# EAGLE design pic18f44k22 dip to tqfp (EAGLE 9.4.0)
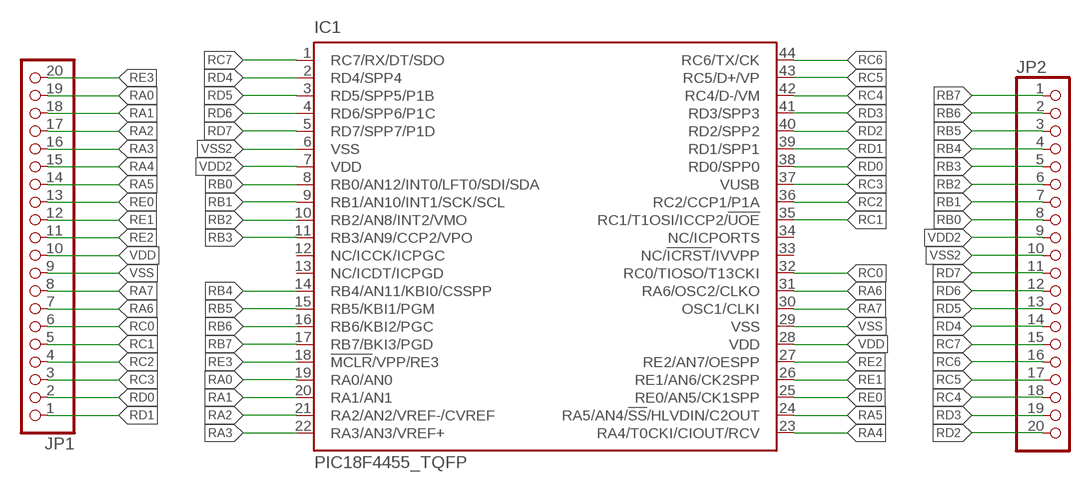
[diagram p0: schematic, sheet 1]

## Parts
IC1  PIC18F4455_TQFP  [TQFP44]
JP1  PINHD-1X20_2.54-SMD  [1X20SMD]
JP2  PINHD-1X20_2.54-SMD  [1X20SMD]

## Nets
RA0: IC1.19(RA0/AN0) JP1.19
RA1: IC1.20(RA1/AN1) JP1.18
RA2: IC1.21(RA2/AN2/VREF-/CVREF) JP1.17
RA3: IC1.22(RA3/AN3/VREF+) JP1.16
RA4: IC1.23(RA4/T0CKI/CIOUT/RCV) JP1.15
RA5: IC1.24(RA5/AN4/!SS!/HLVDIN/C2OUT) JP1.14
RA6: IC1.31(RA6/OSC2/CLKO) JP1.7
RA7: IC1.30(OSC1/CLKI) JP1.8
RB0: IC1.8(RB0/AN12/INT0/LFT0/SDI/SDA) JP2.8
RB1: IC1.9(RB1/AN10/INT1/SCK/SCL) JP2.7
RB2: IC1.10(RB2/AN8/INT2/VMO) JP2.6
RB3: IC1.11(RB3/AN9/CCP2/VPO) JP2.5
RB4: IC1.14(RB4/AN11/KBI0/CSSPP) JP2.4
RB5: IC1.15(RB5/KBI1/PGM) JP2.3
RB6: IC1.16(RB6/KBI2/PGC) JP2.2
RB7: IC1.17(RB7/BKI3/PGD) JP2.1
RC0: IC1.32(RC0/TIOSO/T13CKI) JP1.6
RC1: IC1.35(RC1/T1OSI/ICCP2/!UOE) JP1.5
RC2: IC1.36(RC2/CCP1/P1A) JP1.4
RC3: IC1.37(VUSB) JP1.3
RC4: IC1.42(RC4/D-/VM) JP2.18
RC5: IC1.43(RC5/D+/VP) JP2.17
RC6: IC1.44(RC6/TX/CK) JP2.16
RC7: IC1.1(RC7/RX/DT/SDO) JP2.15
RD0: IC1.38(RD0/SPP0) JP1.2
RD1: IC1.39(RD1/SPP1) JP1.1
RD2: IC1.40(RD2/SPP2) JP2.20
RD3: IC1.41(RD3/SPP3) JP2.19
RD4: IC1.2(RD4/SPP4) JP2.14
RD5: IC1.3(RD5/SPP5/P1B) JP2.13
RD6: IC1.4(RD6/SPP6/P1C) JP2.12
RD7: IC1.5(RD7/SPP7/P1D) JP2.11
RE0: IC1.25(RE0/AN5/CK1SPP) JP1.13
RE1: IC1.26(RE1/AN6/CK2SPP) JP1.12
RE2: IC1.27(RE2/AN7/OESPP) JP1.11
RE3: IC1.18(!MCLR!/VPP/RE3) JP1.20
VDD: IC1.28(VDD) JP1.10
VDD2: IC1.7(VDD) JP2.9
VSS: IC1.29(VSS) JP1.9
VSS2: IC1.6(VSS) JP2.10
Unconnected: IC1.12(NC/ICCK/ICPGC) IC1.13(NC/ICDT/ICPGD) IC1.33(NC/!ICRST!/IVVPP) IC1.34(NC/ICPORTS)

## Library data of the parts
IC1 = microchip:PIC18F4*_TQFP: USB Microcontrollers with nanoWatt Technology High-Performance, Enhanced Flash, 28/40/44-Pin, Source: http://ww1.microchip.com/downloads/en/devicedoc/39632c.pdf; MF: MICROCHIP; MPN: PIC18F4455-I/PT; OC_FARNELL: 9321322; OC_NEWARK: 08J9628
JP1 JP2 = pinhead-2:PINHD-1X20: PIN HEADER

## Board
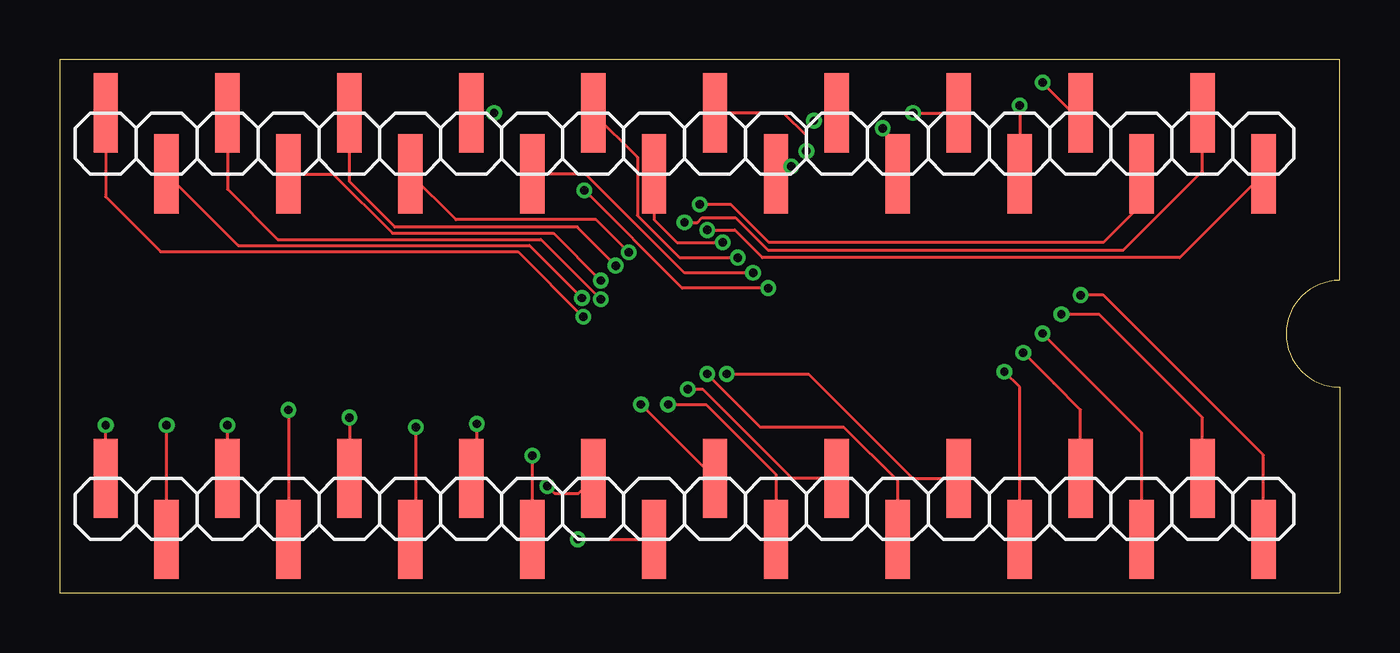
[diagram p1: board, top side]
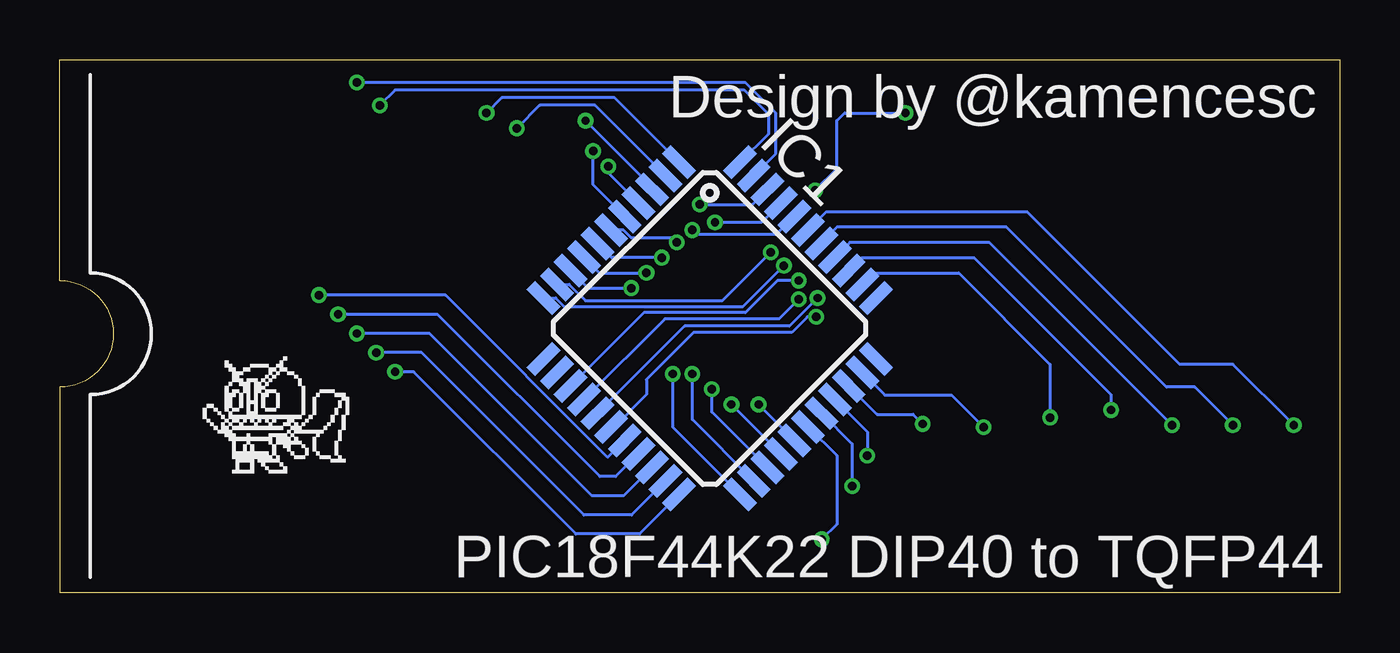
[diagram p2: board, bottom side, seen from below]

Size 53.34 x 22.21 mm. Coordinates in mm from the lower left corner, seen from the top.
Outline: 0,0 53.34,0 53.34,8.57 arc-180 53.34,13.02 53.34,22.21 0,22.21 0,0
Copper layers (1*16): Top 0.035mm / dielectric 1.5mm / Bottom 0.035mm
Design rules "dirtypcbs_2_layer": minimum track width 5mil, minimum drill 12mil, track to track 5mil, track to pad 5mil, pad to pad 5mil, via to via 5mil, smd to smd 0mil, copper to edge 10mil, drill to drill 10mil, minimum pad ring 10mil, minimum via ring 6mil, stop-mask expansion 2mil, vias tented up to drill 25mil, thermal gap 10mil

### Footprints (pad centres in the part's own frame; a part is rotated, then mirrored left to right if it is on the bottom)
TQFP44 = smd 1.5 x 0.5: 1 -5.8,4; 2 -5.8,3.2; 3 -5.8,2.4; 4 -5.8,1.6; 5 -5.8,0.8; 6 -5.8,0; 7 -5.8,-0.8; 8 -5.8,-1.6; 9 -5.8,-2.4; 10 -5.8,-3.2; 11 -5.8,-4; 23 5.8,-4; 24 5.8,-3.2; 25 5.8,-2.4; 26 5.8,-1.6; 27 5.8,-0.8; 28 5.8,0; 29 5.8,0.8; 30 5.8,1.6; 31 5.8,2.4; 32 5.8,3.2; 33 5.8,4 | smd 0.5 x 1.5: 12 -4,-5.8; 13 -3.2,-5.8; 14 -2.4,-5.8; 15 -1.6,-5.8; 16 -0.8,-5.8; 17 0,-5.8; 18 0.8,-5.8; 19 1.6,-5.8; 20 2.4,-5.8; 21 3.2,-5.8; 22 4,-5.8; 34 4,5.8; 35 3.2,5.8; 36 2.4,5.8; 37 1.6,5.8; 38 0.8,5.8; 39 0,5.8; 40 -0.8,5.8; 41 -1.6,5.8; 42 -2.4,5.8; 43 -3.2,5.8; 44 -4,5.8
1X20SMD = smd 1.016 x 3.302: 1 -1.27,1.27; 2 1.27,-1.27; 3 3.81,1.27; 4 6.35,-1.27; 5 8.89,1.27; 6 11.43,-1.27; 7 13.97,1.27; 8 16.51,-1.27; 9 19.05,1.27; 10 21.59,-1.27; 11 24.13,1.27; 12 26.67,-1.27; 13 29.21,1.27; 14 31.75,-1.27; 15 34.29,1.27; 16 36.83,-1.27; 17 39.37,1.27; 18 41.91,-1.27; 19 44.45,1.27; 20 46.99,-1.27

### Placement (x,y rotation side)
IC1  26.26,11.02 315 bottom
JP1  3.17,3.49 0 top
JP2  3.17,18.73 0 top

### Tracks (layer width: path | path; a pad name or v marks a point on that pad's centre or on a via)
RA0  (via drill 0.35)
  Top 0.127: JP1.19 47.62,7.3 43.32,11.61 v41.75,11.61
  Bottom 0.127: IC1.19 30.17,4.84 30.84,4.84 37.6,11.61 v41.75,11.61
RA1  (via drill 0.35)
  Top 0.127: JP1.18 45.09,6.68 v40.96,10.81
  Bottom 0.127: IC1.20 29.84,4.04 31.17,4.04 37.93,10.81 v40.96,10.81
RA2  (via drill 0.35)
  Top 0.127: 41.43,8.74 | v40.16,10.01 41.43,8.74 | JP1.17 42.55,7.62 41.43,8.74
  Bottom 0.127: IC1.21 29.51,3.24 31.5,3.24 38.26,10.01 v40.16,10.01
RA3  (via drill 0.35)
  Top 0.127: JP1.16 40.01,8.57 v39.37,9.21
  Bottom 0.127: v39.37,9.21 38.59,9.21 31.83,2.44 29.18,2.44 IC1.22
RA4  (via drill 0.35)
  Top 0.127: v27.79,9.12 31.2,9.12 35.56,4.76 JP1.15
  Bottom 0.127: v27.79,9.12 27.79,6.9 IC1.23
RA5  (via drill 0.35)
  Top 0.127: JP1.14 34.93,4.65 32.68,6.9 29.2,6.9 v26.98,9.12
  Bottom 0.127: v26.98,9.12 26.98,7.21 IC1.24
RA6  (via drill 0.35)
  Top 0.127: v17.37,7.03 17.37,4.99 JP1.7
  Bottom 0.127: IC1.31 19.28,7.44 17.78,7.44 v17.37,7.03
RA7  (via drill 0.35)
  Top 0.127: v19.68,5.71 JP1.8
  Bottom 0.127: IC1.30 19.68,6.71 v19.68,5.71
RB0  (via drill 0.35)
  Top 0.127: v28.89,13.33 26.04,13.33 21.91,17.46 JP2.8
  Bottom 0.127: IC1.8 30.84,13.33 v28.89,13.33
RB1  (via drill 0.35)
  Top 0.127: v29.53,12.7 25.94,12.7 v21.86,16.78 | v18.1,20 JP2.7
  Bottom 0.127: IC1.9 31.33,12.7 v29.53,12.7 | v21.86,16.78 20.95,17.68 20.95,19.69 20.64,20 v18.1,20
RB2  (via drill 0.35)
  Top 0.127: v23.71,14.19 22.35,15.56 16.51,15.56 JP2.6
  Bottom 0.127: IC1.10 32.12,12.86 31.44,12.18 25.72,12.18 v23.71,14.19
RB3  (via drill 0.35)
  Top 0.127: v23.16,13.64 21.59,15.21 21.59,15.24 13.97,15.24 12.06,17.14 JP2.5
  Bottom 0.127: IC1.11 32.68,12.29 32.32,11.93 24.87,11.93 v23.16,13.64
RB4  (via drill 0.35)
  Top 0.127: v22.54,13.02 20.57,14.99 13.87,14.99 11.39,17.46 JP2.4
  Bottom 0.127: v22.54,13.02 23.42,13.02 24.77,11.67 29,11.67 IC1.14
RB5  (via drill 0.35)
  Top 0.127: JP2.3 6.99,16.83 9.08,14.73 20.05,14.73 v22.54,12.24
  Bottom 0.127: v22.54,12.24 23.36,11.42 28.12,11.42 IC1.15
RB6  (via drill 0.35)
  Top 0.127: JP2.2 7.43,14.48 19.57,14.48 v21.76,12.29
  Bottom 0.127: v21.76,12.29 22.93,11.11 27.3,11.11 IC1.16
RB7  (via drill 0.35)
  Top 0.127: JP2.1 1.91,16.51 4.19,14.22 19.09,14.22 v21.81,11.5
  Bottom 0.127: v21.81,11.5 22.18,11.5 22.83,10.86 26.92,10.86 28.89,8.89 28.89,8.25 30.23,6.92 IC1.17
RC0  (via drill 0.35)
  Top 0.127: v14.83,6.9 14.83,2.45 JP1.6
  Bottom 0.127: IC1.32 18.95,8.24 16.17,8.24 v14.83,6.9
RC1  (via drill 0.35)
  Top 0.127: v12.06,7.3 JP1.5
  Bottom 0.127: IC1.35 19.42,13.33 15.88,13.33 12.06,9.52 v12.06,7.3
RC2  (via drill 0.35)
  Top 0.127: v9.53,7.62 JP1.4
  Bottom 0.127: IC1.36 19.91,13.97 15.24,13.97 9.53,8.25 v9.53,7.62
RC3  (via drill 0.35)
  Top 0.127: JP1.3 v6.99,6.99
  Bottom 0.127: IC1.37 20.41,14.6 14.61,14.6 v6.99,6.99
RC4  (via drill 0.35)
  Top 0.127: JP2.18 45.09,16.19 43.5,14.6 29.55,14.6 27.96,16.19 v26.67,16.19
  Bottom 0.127: v26.67,16.19 24.48,16.19 IC1.42
RC5  (via drill 0.35)
  Top 0.127: v40.96,21.27 42.23,20 JP2.17
  Bottom 0.127: IC1.43 23.49,18.31 23.49,20 24.76,21.27 v40.96,21.27
RC6  (via drill 0.35)
  Top 0.127: v40.01,20.32 JP2.16
  Bottom 0.127: v40.01,20.32 39.37,20.96 24.81,20.96 23.81,19.96 23.81,19.12 IC1.44
RC7  (via drill 0.35)
  Top 0.127: v35.56,20 JP2.15
  Bottom 0.127: IC1.1 30.22,20.64 34.93,20.64 v35.56,20
RD0  (via drill 0.35)
  Top 0.127: JP1.2 v4.45,6.99
  Bottom 0.127: v4.45,6.99 6.03,8.57 7.22,8.57 13.89,15.24 20.95,15.24 21.59,14.6 IC1.38
RD1  (via drill 0.35)
  Top 0.127: JP1.1 v1.91,6.99
  Bottom 0.127: v1.91,6.99 4.45,9.52 6.67,9.52 13.02,15.87 21.4,15.87 IC1.39
RD2  (via drill 0.35)
  Top 0.127: JP2.20 46.67,13.97 29.28,13.97 28.13,15.12 v26.99,15.12
  Bottom 0.127: IC1.40 23.49,14.92 26.79,14.92 v26.99,15.12
RD3  (via drill 0.35)
  Top 0.127: v26.04,15.44 26.57,15.44 26.77,15.64 28.15,15.64 29.51,14.29 44.34,14.29 47.62,17.57 JP2.19
  Bottom 0.127: IC1.41 24.1,15.44 v26.04,15.44
RD4  (via drill 0.35)
  Top 0.127: v34.29,19.37 34.93,18.73 JP2.14
  Bottom 0.127: IC1.2 31.04,20.32 33.34,20.32 v34.29,19.37
RD5  (via drill 0.35)
  Top 0.127: JP2.13 31.75,20 v31.43,19.69
  Bottom 0.127: v31.43,19.69 28.66,16.92 IC1.3
RD6  (via drill 0.35)
  Top 0.127: v30.48,17.78 30.16,17.46 JP2.12
  Bottom 0.127: IC1.4 30.48,17.5 v30.48,17.78
RD7  (via drill 0.35)
  Top 0.127: v31.11,18.42 31.11,19.05 30.16,20 JP2.11
  Bottom 0.127: IC1.5 31.11,17.01 v31.11,18.42
RE0  (via drill 0.35)
  Top 0.127: JP1.13 30.52,4.76 26.8,8.48 v26.16,8.48
  Bottom 0.127: IC1.25 24.56,5.93 | 24.56,5.93 | v26.16,8.48 26.16,7.53 24.56,5.93
RE1  (via drill 0.35)
  Top 0.127: v25.35,7.85 26.94,7.85 29.84,4.94 JP1.12
  Bottom 0.127: IC1.26 24,6.5 | 24,6.5 | 24,6.5 v25.35,7.85
RE2  (via drill 0.35)
  Top 0.127: JP1.11 v24.22,7.85 | v24.22,7.85
  Bottom 0.127: IC1.27 v24.22,7.85
RE3  (via drill 0.35)
  Top 0.127: JP1.20 50.16,5.74 43.5,12.41 v42.55,12.41
  Bottom 0.127: IC1.18 30.5,5.64 37.27,12.41 v42.55,12.41
VDD  (via drill 0.35)
  Top 0.127: v21.59,2.22 JP1.10
  Bottom 0.127: IC1.28 20.95,5.71 20.95,2.86 v21.59,2.22
VDD2  (via drill 0.35)
  Top 0.127: JP2.9 24.07,18.16 24.07,15.73 25.83,13.97 v28.26,13.97
  Bottom 0.127: v28.26,13.97 30.34,13.97 IC1.7
VSS  (via drill 0.35)
  Top 0.127: v20.32,4.45 20.64,4.13 21.59,4.13 JP1.9
  Bottom 0.127: IC1.29 20.32,6.21 v20.32,4.45
VSS2  (via drill 0.35)
  Top 0.127: JP2.10 24.76,15.56 25.72,14.6 v27.62,14.6
  Bottom 0.127: IC1.6 29.85,15.12 29.52,14.79 27.81,14.79 v27.62,14.6

### Text on the board
bNames: Design by @kamencesc | PIC18F44K22 DIP40 to TQFP44